# Altium project MQP_DC_AC_Inverter.PrjPcb (part 4 of 4)
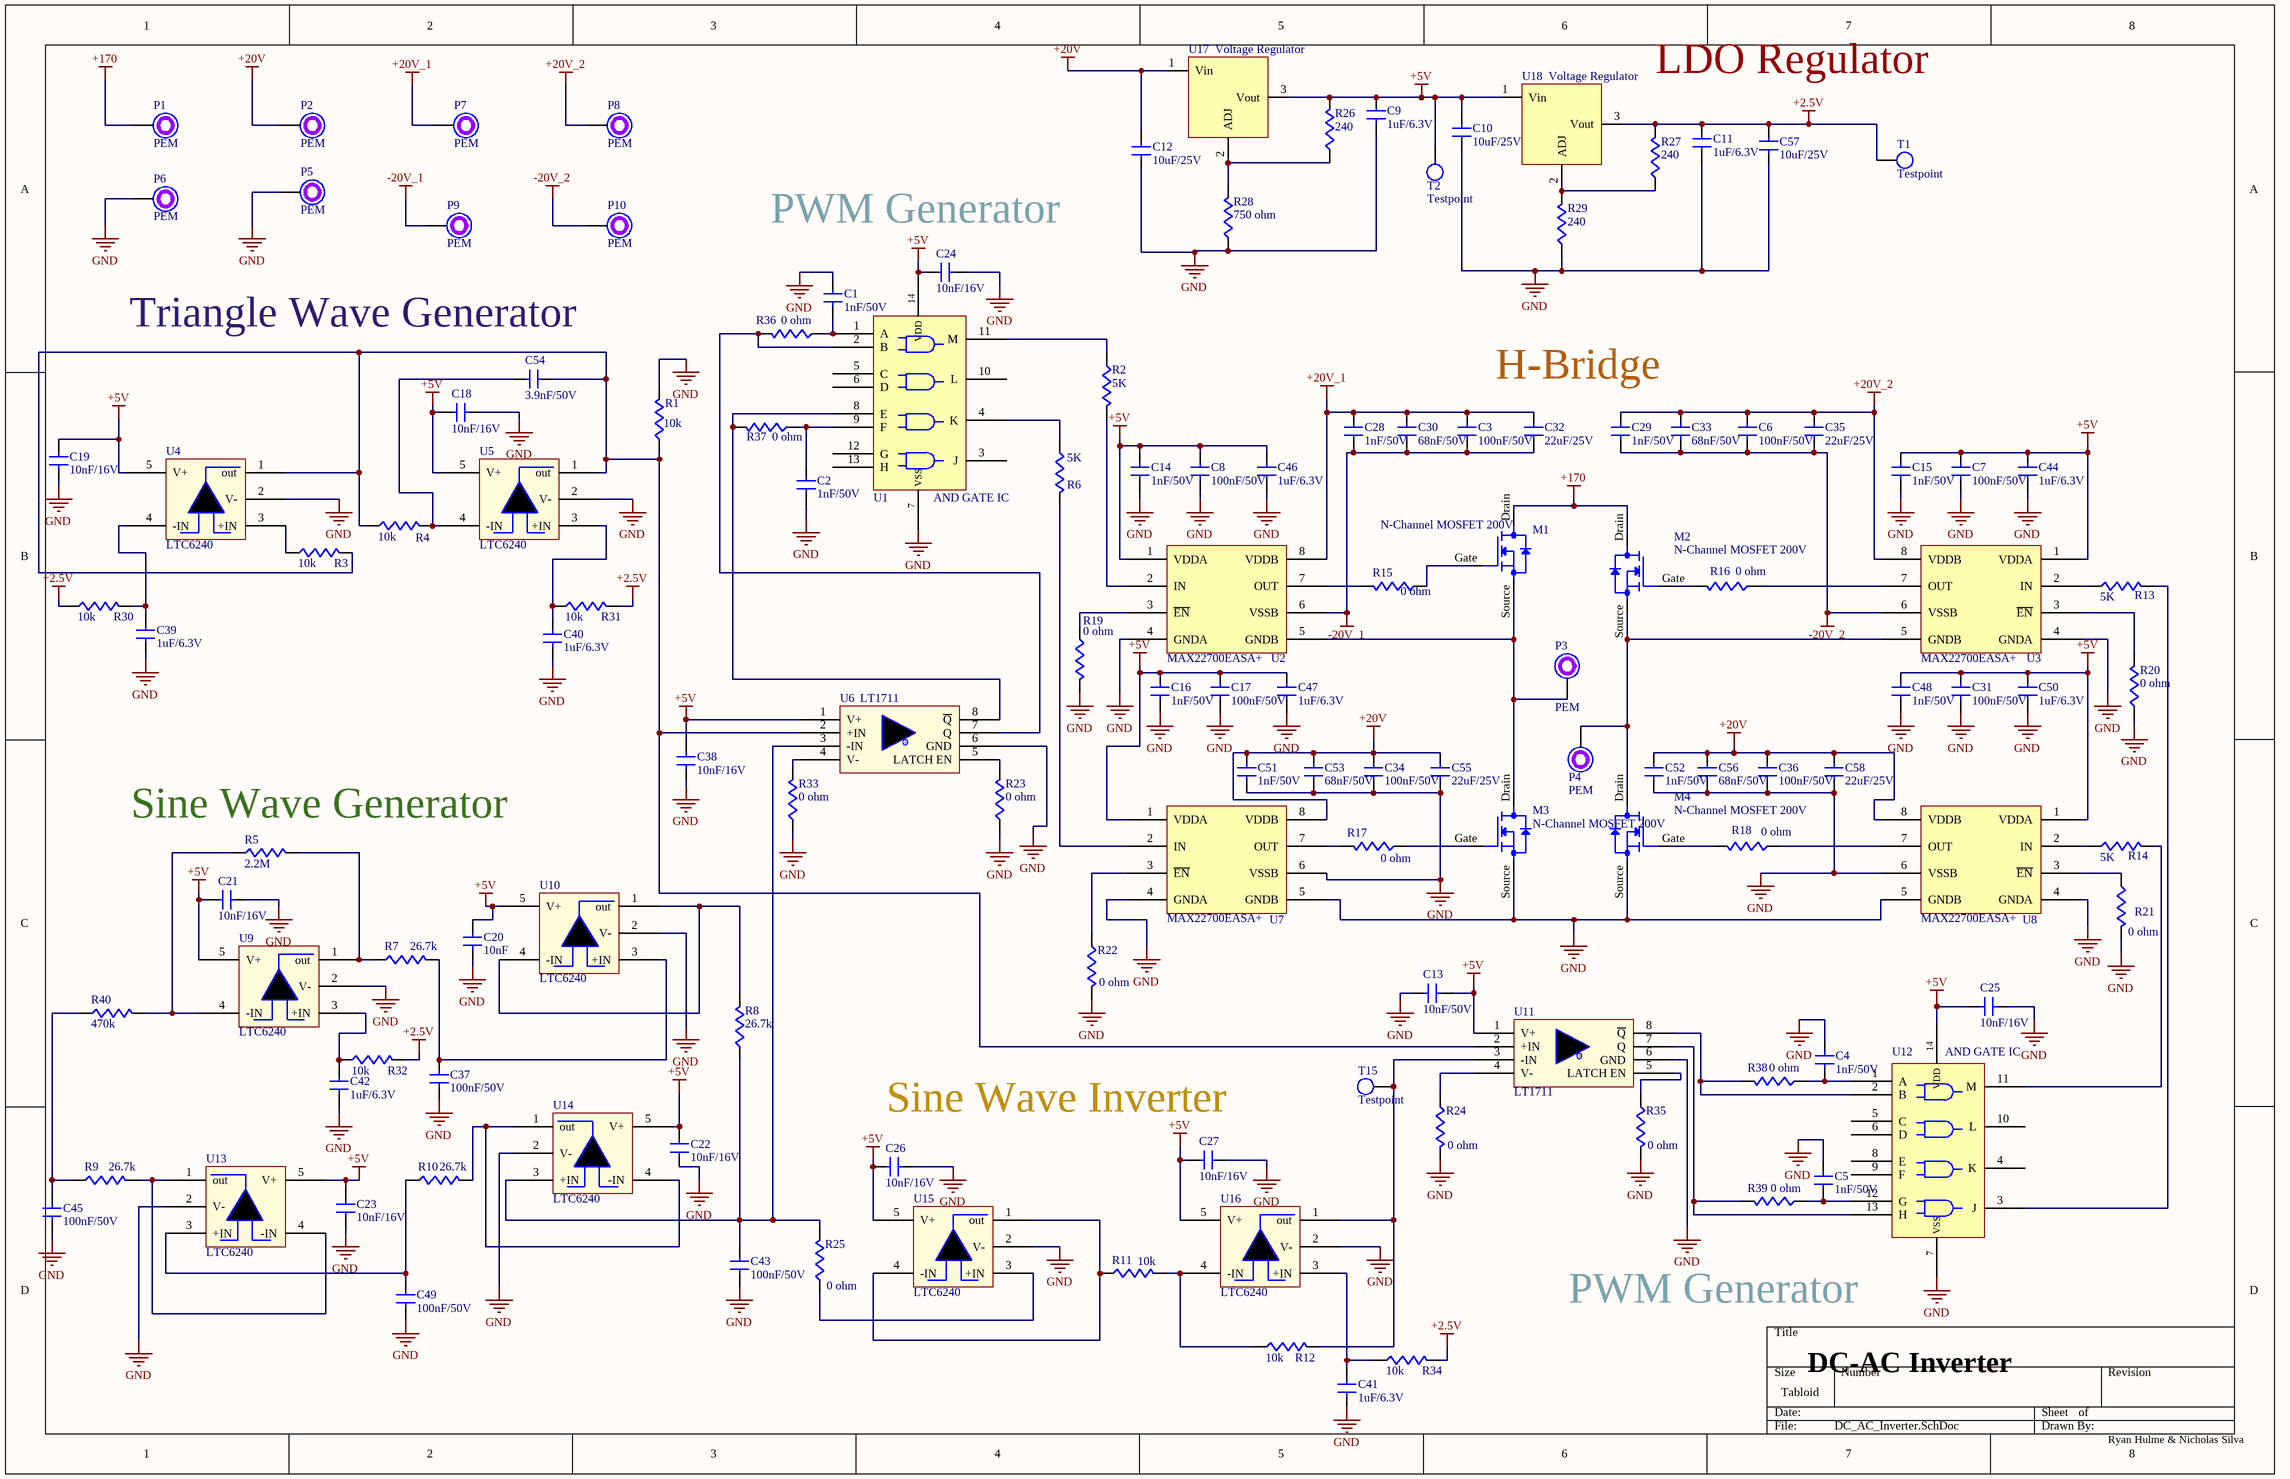
[diagram p3: DC_AC_Inverter.SchDoc]

## Sheet DC_AC_Inverter.SchDoc (continued)

### Library data of the parts (continued)
U1 U12 = CD4081BNSR: AND CD4081 EAR99 4000B logic gate circuit 90ns @ 15V 50pF 2mm 3.4mA 3.4mA 3.5V-11V; Manufacturer: Texas Instruments; Manufacturer Lifecycle Status: ACTIVE; High Level Output Current: -4.2mA; Low Level Output Current: 4.2mA; Max Supply Voltage: 18V; Min Supply Voltage: 3V; Number of Bits: 4; Number of Input Lines: 2; Number of Output Lines: 1; Output Current: 6.8mA; Quiescent Current: 5µA; Turn-On Delay Time: 12ns; Supplier: DigiKey; Supplier Part Number: 296-14140-1-ND; Manufacturer Part Number: CD4081BNSR; RoHS: Compliant; Category: Logic Gates; Stock: 18442; Pricing: 1=1.05, 10=0.759, 25=0.6852, 100=0.6044, 250=0.56576, 500=0.54468 (USD); Case/Package: SOP; Contact Plating: Gold; Height: 2mm; Lead Free: Lead Free; Length: 10.3mm; Lifecycle Status: Production; Logic Function: AND; Max Operating Temperature: 125°C; Min Operating Temperature: -55°C; Mounting Technology: Surface Mount; Number of Circuits: 4; Number of Elements: 4; Number of Gates: 4; Number of Inputs: 2; Number of Outputs: 1; Pins: 14; Packaging: Tape & Reel (TR); Propagation Delay: 90ns; Radiation Hardening: No; REACH SVHC: Unknown; Schedule B: 8542390000, 8542390000|8542390000|8542390000|8542390000|8542390000; Thickness: 1.95mm; Weight: 208.312296mg; Width: 5.3mm; ComponentLink1URL: https://datasheet.octopart.com:443/CD4081BNSR-Texas-Instruments-datasheet-10794629.pdf?src-supplier=Texas+Instruments; ComponentLink1Description: https://datasheet.octopart.com:443/CD4081BNSR-Texas-Instruments-datasheet-10794629.pdf?src-supplier=Texas+Instruments; ComponentLink2URL: https://octopart.com:443/opatz8j6/c1?t=YxbNdJKEROS6Vm5KtYNJ_JyZt7EceMX1SIRKQtAb4Y8lWUVkYy39ZyZsE2-WATvXZN4TSf20npuENvJODiCamDGCNWilka1l9iY4MkQYjKrpUEBaOEb4I2_cjKmMvO0DzDUmCdmSlAdJj-YSBZskjReuIVWeu6zcmJhI4EWYC-jOIWhKVjLUC_2s64ZlV_TJwr1GUdjj7NQs9rSYcxVAXH8GRRzJ5L1klAQGmdoT7dVvhwtaa6KXKHm16KdF4QYR2F57j4FMw7rbM3S3FyRlCmusYW7cmmmcGzT9BesW2olY17NxMao1sKhRxMKa-IHifCTXBKwmACtW2WB27Rp4O6n1txafArR9v5gRBTXi256STLSQN5zqflUpFaagCkJJpZWf&src-supplier=Texas+Instruments; ComponentLink2Description: https://octopart.com:443/opatz8j6/c1?t=YxbNdJKEROS6Vm5KtYNJ_JyZt7EceMX1SIRKQtAb4Y8lWUVkYy39ZyZsE2-WATvXZN4TSf20npuENvJODiCamDGCNWilka1l9iY4MkQYjKrpUEBaOEb4I2_cjKmMvO0DzDUmCdmSlAdJj-YSBZskjReuIVWeu6zcmJhI4EWYC-jOIWhKVjLUC_2s64ZlV_TJwr1GUdjj7NQs9rSYcxVAXH8GRRzJ5L1klAQGmdoT7dVvhwtaa6KXKHm16KdF4QYR2F57j4FMw7rbM3S3FyRlCmusYW7cmmmcGzT9BesW2olY17NxMao1sKhRxMKa-IHifCTXBKwmACtW2WB27Rp4O6n1txafArR9v5gRBTXi256STLSQN5zqflUpFaagCkJJpZWf&src-supplier=Texas+Instruments; ComponentLink3URL: https://datasheet.octopart.com:443/CD4081BNSR-Texas-Instruments-datasheet-10253444.pdf?src-supplier=Texas+Instruments; ComponentLink3Description: https://datasheet.octopart.com:443/CD4081BNSR-Texas-Instruments-datasheet-10253444.pdf?src-supplier=Texas+Instruments; ComponentLink4URL: https://sigma.octopart.com:443/49249817/technical_drawing/Texas-Instruments-CD4081BNSR.pdf?src-supplier=Texas+Instruments; ComponentLink4Description: https://sigma.octopart.com:443/49249817/technical_drawing/Texas-Instruments-CD4081BNSR.pdf?src-supplier=Texas+Instruments; ComponentLink5URL: https://datasheet.octopart.com:443/CD4081BNSR-Texas-Instruments-datasheet-151253.pdf?src-supplier=Texas+Instruments; ComponentLink5Description: https://datasheet.octopart.com:443/CD4081BNSR-Texas-Instruments-datasheet-151253.pdf?src-supplier=Texas+Instruments; ComponentLink6URL: https://datasheet.octopart.com:443/CD4081BNSR-Texas-Instruments-datasheet-10253518.pdf?src-supplier=Texas+Instruments; ComponentLink6Description: https://datasheet.octopart.com:443/CD4081BNSR-Texas-Instruments-datasheet-10253518.pdf?src-supplier=Texas+Instruments; ComponentLink7URL: https://datasheet.octopart.com:443/CD4081BNSR-Texas-Instruments-datasheet-164413312.pdf?src-supplier=SHENGYU+ELECTRONICS; ComponentLink7Description: https://datasheet.octopart.com:443/CD4081BNSR-Texas-Instruments-datasheet-164413312.pdf?src-supplier=SHENGYU+ELECTRONICS; ComponentLink8URL: https://datasheet.octopart.com:443/CD4081BNSR-Texas-Instruments-datasheet-47642733.pdf?src-supplier=Newark; ComponentLink8Description: https://datasheet.octopart.com:443/CD4081BNSR-Texas-Instruments-datasheet-47642733.pdf?src-supplier=Newark; ComponentLink9URL: https://datasheet.octopart.com:443/CD4081BNSR-Texas-Instruments-datasheet-27379352.pdf?src-supplier=Newark; ComponentLink9Description: https://datasheet.octopart.com:443/CD4081BNSR-Texas-Instruments-datasheet-27379352.pdf?src-supplier=Newark; ComponentLink10URL: https://datasheet.octopart.com:443/CD4081BNSR-Texas-Instruments-datasheet-11534476.pdf?src-supplier=Newark; ComponentLink10Description: https://datasheet.octopart.com:443/CD4081BNSR-Texas-Instruments-datasheet-11534476.pdf?src-supplier=Newark; ComponentLink11URL: https://datasheet.octopart.com:443/CD4081BNSR-Texas-Instruments-datasheet-14147925.pdf?src-supplier=iiiC; ComponentLink11Description: https://datasheet.octopart.com:443/CD4081BNSR-Texas-Instruments-datasheet-14147925.pdf?src-supplier=iiiC; ComponentLink12URL: https://datasheet.octopart.com:443/CD4081BNSR-Texas-Instruments-datasheet-10549843.pdf?src-supplier=Factory+Futures; ComponentLink12Description: https://datasheet.octopart.com:443/CD4081BNSR-Texas-Instruments-datasheet-10549843.pdf?src-supplier=Factory+Futures; ComponentLink13URL: https://datasheet.octopart.com:443/CD4081BNSR-Texas-Instruments-datasheet-32637.pdf?src-supplier=DigiKey; ComponentLink13Description: https://datasheet.octopart.com:443/CD4081BNSR-Texas-Instruments-datasheet-32637.pdf?src-supplier=DigiKey; ComponentLink14URL: http://sigma.octopart.com:80/reach_statement/Texas-Instruments-company-64.pdf?src-supplier=Compliance+Statements; ComponentLink14Description: http://sigma.octopart.com:80/reach_statement/Texas-Instruments-company-64.pdf?src-supplier=Compliance+Statements; ComponentLink15URL: http://sigma.octopart.com:80/conflict_mineral_statement/Texas-Instruments-company-63.pdf?src-supplier=Compliance+Statements; ComponentLink15Description: http://sigma.octopart.com:80/conflict_mineral_statement/Texas-Instruments-company-63.pdf?src-supplier=Compliance+Statements
U2 U3 U7 U8 = MAX22700EASA+: MOSFET and Power Driver 5.7A Single Hi/Lo Side Inv/Non-Inv 8-Pin SOIC N; Manufacturer: Analog Devices; Manufacturer Lifecycle Status: PRODUCTION; Supplier: DigiKey; Manufacturer Part Number: MAX22700EASA+; RoHS: Compliant; Category: Gate Drivers; Stock: 18; Pricing: 1=4.56, 10=3.467, 25=3.1924, 100=2.8907, 300=2.72233, 500=2.66008, 1000=2.58869, 2500=2.51336 (USD); Lifecycle Status: Production; ComponentLink1URL: https://octopart.com:443/opatz8j6/c1?t=d9IZSUmFVmeiFEza4JYbjCWptqKSo-oQrcC1b9HLTjM8SgyuA4rt-UKLM_lg9g92uG_YGkggQNQDDUh9x4eYhYYEMlQ8EOGcy0xOKi9661-_2CNFuO_xUPCr0tlrUuDNx5JxL_q4fqwVbfWNc6gzFK95mza5n0-2OqiRTSdQMqBJJ3jfFhDTTNhArzy4ja8X3-lVsfTDz1_T9Hz63hwEk8N8vFkwyr2QE6k72H11354Duarn8LyBg1osG7gxDlOgtPiAaIzdtHupEHI9cRpmJmLPIvktPYVFuVJHI9DYJJb4FuPS1DQFZqpfVzQ&src-supplier=Analog+Devices; ComponentLink1Description: https://octopart.com:443/opatz8j6/c1?t=d9IZSUmFVmeiFEza4JYbjCWptqKSo-oQrcC1b9HLTjM8SgyuA4rt-UKLM_lg9g92uG_YGkggQNQDDUh9x4eYhYYEMlQ8EOGcy0xOKi9661-_2CNFuO_xUPCr0tlrUuDNx5JxL_q4fqwVbfWNc6gzFK95mza5n0-2OqiRTSdQMqBJJ3jfFhDTTNhArzy4ja8X3-lVsfTDz1_T9Hz63hwEk8N8vFkwyr2QE6k72H11354Duarn8LyBg1osG7gxDlOgtPiAaIzdtHupEHI9cRpmJmLPIvktPYVFuVJHI9DYJJb4FuPS1DQFZqpfVzQ&src-supplier=Analog+Devices; ComponentLink2URL: https://datasheet.octopart.com:443/MAX22700EASA%2B-Analog-Devices-datasheet-145303846.pdf?src-supplier=Ciiva; ComponentLink2Description: https://datasheet.octopart.com:443/MAX22700EASA%2B-Analog-Devices-datasheet-145303846.pdf?src-supplier=Ciiva; ComponentLink3URL: http://sigma.octopart.com:80/conflict_mineral_statement/Analog-Devices-company-33.pdf?src-supplier=Compliance+Statements; ComponentLink3Description: http://sigma.octopart.com:80/conflict_mineral_statement/Analog-Devices-company-33.pdf?src-supplier=Compliance+Statements; ComponentLink4URL: http://sigma.octopart.com:80/conflict_mineral_statement/Maxim-Integrated-company-65.pdf?src-supplier=Compliance+Statements; ComponentLink4Description: http://sigma.octopart.com:80/conflict_mineral_statement/Maxim-Integrated-company-65.pdf?src-supplier=Compliance+Statements; ComponentLink5URL: http://sigma.octopart.com:80/rohs_statement/Maxim-Integrated-company-66.pdf?src-supplier=Compliance+Statements; ComponentLink5Description: http://sigma.octopart.com:80/rohs_statement/Maxim-Integrated-company-66.pdf?src-supplier=Compliance+Statements; ComponentLink6URL: http://sigma.octopart.com:80/reach_statement/Maxim-Integrated-company-67.pdf?src-supplier=Compliance+Statements; ComponentLink6Description: http://sigma.octopart.com:80/reach_statement/Maxim-Integrated-company-67.pdf?src-supplier=Compliance+Statements; ComponentLink7URL: https://octopart.com:443/opatz8j6/c1?t=uq9ks65Rkl-f3xSZdxgFjQRktIJqr0XuISwlccZ9Be3A96kxw8KZXdJ2R1X8XijkZLzXX_Xf2iZ_1EYJiUW-k3O4zzF9VXGePyBlVwW68QXhCbuH73gJl5377Ogb3TIEqv1OFx2-kQa3MNaShuM43P0kqkThB15XIv8QEBeG0XiKApOZKBhFvtXuZuIU7_A7qb6Iwuw6Bk-DseikFnDV46qMQ0MwWtmQC_KZQpuB1lSHH6Kpq4IZwI1eexe3v5AcbCWclbrw0yEalPIZQxO6oIfrtCgyasXv1NOmGCZnwU25xZx-CHft1dwr-KU&src-supplier=Compliance+Statements; ComponentLink7Description: https://octopart.com:443/opatz8j6/c1?t=uq9ks65Rkl-f3xSZdxgFjQRktIJqr0XuISwlccZ9Be3A96kxw8KZXdJ2R1X8XijkZLzXX_Xf2iZ_1EYJiUW-k3O4zzF9VXGePyBlVwW68QXhCbuH73gJl5377Ogb3TIEqv1OFx2-kQa3MNaShuM43P0kqkThB15XIv8QEBeG0XiKApOZKBhFvtXuZuIU7_A7qb6Iwuw6Bk-DseikFnDV46qMQ0MwWtmQC_KZQpuB1lSHH6Kpq4IZwI1eexe3v5AcbCWclbrw0yEalPIZQxO6oIfrtCgyasXv1NOmGCZnwU25xZx-CHft1dwr-KU&src-supplier=Compliance+Statements; Supplier Part Number: 505-MAX22700EASA+-ND
U4 U5 U9 U10 U13-U16 = LTC6240HVCS5#TRPBF: Single 18MHz, Low Noise, Rail-to-Rail Output, CMOS Op Amp; Manufacturer: Analog Devices; Manufacturer Lifecycle Status: PRODUCTION; Common Mode Rejection Ratio: 80dB; Input Bias Current: 500fA; Input Offset Voltage (Vos): 40µV; Max Dual Supply Voltage: 5.5V; Max Supply Voltage: 12V; Min Dual Supply Voltage: 1.4V; Min Supply Voltage: 2.8V; Number of Channels: 1; Operating Supply Current: 2.7mA; Output Current per Channel: 35mA; Slew Rate: 10V/µs; Voltage Gain: 124.08dB; Supplier: DigiKey; Supplier Part Number: LTC6240HVCS5#TRPBFCT-ND; Manufacturer Part Number: LTC6240HVCS5#TRPBF; RoHS: Compliant; Category: Amplifiers - Op Amps, Buffer, Instrumentation; Stock: 608; Pricing: 1=5.62, 10=3.682, 25=3.178, 100=2.6081, 250=2.32816, 500=2.15598, 1000=2.0875 (USD); Case/Package: SOT-23-5; Gain Bandwidth Product: 18MHz; Lifecycle Status: Production; Max Operating Temperature: 70°C; Min Operating Temperature: 0°C; Nominal Gain Bandwidth Product: 18MHz; Number of Circuits: 1; Number of Elements: 1; Pins: 5; Power Supply Rejection Ratio (PSRR): 80dB; Schedule B: 8542330000; ComponentLink1URL: https://octopart.com:443/opatz8j6/c1?t=EoJOC4xHGWqq0IzwURpvuTilUJr6oxn8FCFETNO4Zq2hCVGiVcszmCedJy3IM0JOiUrIiZW9OAkJEQuEVAP-9E-dA8NA1y2i1SkXDiRrK1hKzR0l3o3qbUhDn6e2gsbGFkXSeOh1NRwjTJqd3iDw0CugYr4FYbUt-t-yfMuHmZvzr6pA2z0fXrsVIGq1zoMZRKJzy6TiYnY4VDdrN1O0MY2z6NltC_O6gViF_xTQrYt4hMzkVZYWRWTFVHrCY31KCHJLiGAuWLJr-XK7_W8ecdUcfdWHr6PujJR28pJyTDxpp5OPCnCSHhk&src-supplier=Analog+Devices; ComponentLink1Description: https://octopart.com:443/opatz8j6/c1?t=EoJOC4xHGWqq0IzwURpvuTilUJr6oxn8FCFETNO4Zq2hCVGiVcszmCedJy3IM0JOiUrIiZW9OAkJEQuEVAP-9E-dA8NA1y2i1SkXDiRrK1hKzR0l3o3qbUhDn6e2gsbGFkXSeOh1NRwjTJqd3iDw0CugYr4FYbUt-t-yfMuHmZvzr6pA2z0fXrsVIGq1zoMZRKJzy6TiYnY4VDdrN1O0MY2z6NltC_O6gViF_xTQrYt4hMzkVZYWRWTFVHrCY31KCHJLiGAuWLJr-XK7_W8ecdUcfdWHr6PujJR28pJyTDxpp5OPCnCSHhk&src-supplier=Analog+Devices; ComponentLink2URL: https://datasheet.octopart.com:443/LTC6240HVCS5%23TRPBF-Analog-Devices-datasheet-10696582.pdf?src-supplier=Upverter; ComponentLink2Description: https://datasheet.octopart.com:443/LTC6240HVCS5%23TRPBF-Analog-Devices-datasheet-10696582.pdf?src-supplier=Upverter; ComponentLink3URL: https://sigma.octopart.com:443/57691980/technical_drawing/Linear-Technology-LTC6240HVCS5%23TRPBF.pdf?src-supplier=Linear+Technology; ComponentLink3Description: https://sigma.octopart.com:443/57691980/technical_drawing/Linear-Technology-LTC6240HVCS5%23TRPBF.pdf?src-supplier=Linear+Technology; ComponentLink4URL: https://datasheet.octopart.com:443/LTC6240HVCS5%23TRPBF-Linear-Technology-datasheet-503439.pdf?src-supplier=Component+Distributors+Inc.; ComponentLink4Description: https://datasheet.octopart.com:443/LTC6240HVCS5%23TRPBF-Linear-Technology-datasheet-503439.pdf?src-supplier=Component+Distributors+Inc.; ComponentLink5URL: http://sigma.octopart.com:80/conflict_mineral_statement/Analog-Devices-company-33.pdf?src-supplier=Compliance+Statements; ComponentLink5Description: http://sigma.octopart.com:80/conflict_mineral_statement/Analog-Devices-company-33.pdf?src-supplier=Compliance+Statements; ComponentLink6URL: https://octopart.com:443/opatz8j6/c1?t=WciAb8yNP9zuV9g87N3rk5A8aCwiNghx0T8LnhJFV6mKRZRGd55L4dKBPqx6qz3aqpltFHBg-8-BEwTcxfVEDGCQmnON-Gh2PRs8fnVgja709s1gnSHSPuZXis5aMSZAZOU881N3PgSj_buHp1gdatZw-Uix3fDtvuX3209Gm_KbWJ2H22rQDQ9m-2pL5NIQ_aaWB8j4M3xvDUEKrJd1jVzLSn7BPdLnFgEQCROBfoqhRN-2s8LQTzaPSFCP_0_4CdaH0GP8ZwV9vcO0T0oUPTEZ_K4gady1_XxW9ouI33HB3rRb-AWCaPQ&src-supplier=Compliance+Statements; ComponentLink6Description: https://octopart.com:443/opatz8j6/c1?t=WciAb8yNP9zuV9g87N3rk5A8aCwiNghx0T8LnhJFV6mKRZRGd55L4dKBPqx6qz3aqpltFHBg-8-BEwTcxfVEDGCQmnON-Gh2PRs8fnVgja709s1gnSHSPuZXis5aMSZAZOU881N3PgSj_buHp1gdatZw-Uix3fDtvuX3209Gm_KbWJ2H22rQDQ9m-2pL5NIQ_aaWB8j4M3xvDUEKrJd1jVzLSn7BPdLnFgEQCROBfoqhRN-2s8LQTzaPSFCP_0_4CdaH0GP8ZwV9vcO0T0oUPTEZ_K4gady1_XxW9ouI33HB3rRb-AWCaPQ&src-supplier=Compliance+Statements
U6 U11 = LT1711CMS8#TRPBF: Comparator, 1 Func, 6000uV Offset-Max, 5.5ns Response Time, PDSO8; Manufacturer: Analog Devices; Manufacturer Lifecycle Status: PRODUCTION; Common Mode Rejection Ratio: 85dB; Dual Supply Voltage: 3V; Hysteresis: 100mV; Input Bias Current: 5µA; Input Offset Voltage (Vos): 5mV; Max Dual Supply Voltage: 3.5V; Max Supply Voltage: 12V; Min Dual Supply Voltage: 1.2V; Min Supply Voltage: 2.4V; Number of Channels: 1; Output Current: 20mA; Output Type: TTL; Propagation Delay: 6ns; Quiescent Current: 22mA; Voltage Gain: 83.52dB; Supplier: DigiKey; Supplier Part Number: LT1711CMS8#TRPBFCT-ND; Manufacturer Part Number: LT1711CMS8#TRPBF; RoHS: Compliant; Category: Comparators; Stock: 597; Pricing: 1=8.28, 10=5.556, 25=4.846, 100=4.0433, 250=3.6492, 500=3.55 (USD); Case/Package: MSOP; Lead Free: Lead Free; Lifecycle Status: Production; Max Operating Temperature: 85°C; Min Operating Temperature: -40°C; Number of Elements: 1; Pins: 8; Packaging: Tape & Reel (TR); Power Supply Rejection Ratio (PSRR): 85dB; Response Time: 5.5ns; ComponentLink1URL: https://datasheet.octopart.com:443/LT1711CMS8%23TRPBF-Analog-Devices-datasheet-10875408.pdf?src-supplier=Upverter; ComponentLink1Description: https://datasheet.octopart.com:443/LT1711CMS8%23TRPBF-Analog-Devices-datasheet-10875408.pdf?src-supplier=Upverter; ComponentLink2URL: https://octopart.com:443/opatz8j6/c1?t=650wlvKgRWePQJ-YQfhsSkbrZKYDfddFKR30Pp4clKTLmQX5EVcfxF7zy-kc5koLkDxHTRYRN_B3Ny87B9bmV_c9SyVMUnfKuNcS4mmeLxWPRV8jKqIUNmt9U3DobyKC0m2MBwfFbz01P5Hy_wy0NXjMJyXdAbGyqFhD_jhyaJfJ26v792jlQm0ErKRp1UjjVY9BZslcaskmKsL6xJsX4oNUx0LtaC6UIuSKqy15rF3GND51pM_3zZ9lo8oMlZmILwm2IzCFUc_NrKjwIWQ5WZVa4euGqcnDRfh7_s6LA3x7C_zoIgl14A&src-supplier=Analog+Devices; ComponentLink2Description: https://octopart.com:443/opatz8j6/c1?t=650wlvKgRWePQJ-YQfhsSkbrZKYDfddFKR30Pp4clKTLmQX5EVcfxF7zy-kc5koLkDxHTRYRN_B3Ny87B9bmV_c9SyVMUnfKuNcS4mmeLxWPRV8jKqIUNmt9U3DobyKC0m2MBwfFbz01P5Hy_wy0NXjMJyXdAbGyqFhD_jhyaJfJ26v792jlQm0ErKRp1UjjVY9BZslcaskmKsL6xJsX4oNUx0LtaC6UIuSKqy15rF3GND51pM_3zZ9lo8oMlZmILwm2IzCFUc_NrKjwIWQ5WZVa4euGqcnDRfh7_s6LA3x7C_zoIgl14A&src-supplier=Analog+Devices; ComponentLink3URL: https://sigma.octopart.com:443/57689691/technical_drawing/Linear-Technology-LT1711CMS8%23TRPBF.pdf?src-supplier=Linear+Technology; ComponentLink3Description: https://sigma.octopart.com:443/57689691/technical_drawing/Linear-Technology-LT1711CMS8%23TRPBF.pdf?src-supplier=Linear+Technology; ComponentLink4URL: https://datasheet.octopart.com:443/LT1711CMS8%23TRPBF-Linear-Technology-datasheet-531423.pdf?src-supplier=Arrow+Electronics; ComponentLink4Description: https://datasheet.octopart.com:443/LT1711CMS8%23TRPBF-Linear-Technology-datasheet-531423.pdf?src-supplier=Arrow+Electronics; ComponentLink5URL: https://datasheet.octopart.com:443/LT1711CMS8%23TRPBF-Linear-Technology-datasheet-8633398.pdf?src-supplier=Component+Distributors+Inc.; ComponentLink5Description: https://datasheet.octopart.com:443/LT1711CMS8%23TRPBF-Linear-Technology-datasheet-8633398.pdf?src-supplier=Component+Distributors+Inc.; ComponentLink6URL: http://sigma.octopart.com:80/conflict_mineral_statement/Analog-Devices-company-33.pdf?src-supplier=Compliance+Statements; ComponentLink6Description: http://sigma.octopart.com:80/conflict_mineral_statement/Analog-Devices-company-33.pdf?src-supplier=Compliance+Statements; ComponentLink7URL: https://octopart.com:443/opatz8j6/c1?t=dAkp5kuc4KinSuP60yLax01msfIdztXowOgvkuxzK3Ra-UG4s06W2o_Xknc9JFX10aGYdTDUDBu2YNVFrkx2WBDwiC1YG88wO0ahyiKjj84zGTHOqe6cdtECQCEg93bmhFrsTCKVU7XbI3Zx06BEHOSu75LsOIq3TdBLQ5RT2DUKzT7jTBeQnoZARtK9_sxDhnuz0peBXUPQFjmRShESnohF-C6lickybiUrna3amnDJggXX-SPCJw8XiYYPkAdcaGi6qpHt1rmN3o5XFTfLIZB1rU2ryKzDVzzLOCbWDs5ZWSHRXIcx7Q&src-supplier=Compliance+Statements; ComponentLink7Description: https://octopart.com:443/opatz8j6/c1?t=dAkp5kuc4KinSuP60yLax01msfIdztXowOgvkuxzK3Ra-UG4s06W2o_Xknc9JFX10aGYdTDUDBu2YNVFrkx2WBDwiC1YG88wO0ahyiKjj84zGTHOqe6cdtECQCEg93bmhFrsTCKVU7XbI3Zx06BEHOSu75LsOIq3TdBLQ5RT2DUKzT7jTBeQnoZARtK9_sxDhnuz0peBXUPQFjmRShESnohF-C6lickybiUrna3amnDJggXX-SPCJw8XiYYPkAdcaGi6qpHt1rmN3o5XFTfLIZB1rU2ryKzDVzzLOCbWDs5ZWSHRXIcx7Q&src-supplier=Compliance+Statements
U17 U18 = LT317AT#PBF: LDO Regulator Pos 1.5A 3-Pin(3+Tab) TO-220; Manufacturer: Analog Devices; Manufacturer Lifecycle Status: PRODUCTION; Dropout Voltage: 2.5V; Max Supply Voltage: 40V; Min Input Voltage: 3V; Number of Channels: 1; Output Type: Adjustable; Output Voltage Accuracy: 1%; Polarity: Positive; Reference Voltage: 1.25V; Supplier: DigiKey; Supplier Part Number: 505-LT317AT#PBF-ND; Manufacturer Part Number: LT317AT#PBF; RoHS: Compliant; Category: Voltage Regulators - Linear; Stock: 773; Pricing: 1=6.37, 10=4.896, 50=4.3046, 100=4.1214, 250=3.928, 500=3.81142, 1000=3.71547, 2500=3.61417 (USD); Case/Package: TO-220; Height: 14.886mm; Lead Free: Lead Free; Length: 10.69mm; Lifecycle Status: Production; Max Operating Temperature: 125°C; Max Output current: 1.5A; Min Current Limit: 1.5A; Min Operating Temperature: 0°C; Mounting Technology: Through Hole; Number of Outputs: 1; Pins: 3; Number of Regulators: 1; Output Current: 1.5A; Packaging: Bulk; REACH SVHC: No; Schedule B: 8542390000, 8542390000|8542390000|8542390000|8542390000|8542390000|8542390000|8542390000|8542390000|8542390000|8542390000|8542390000|8542390000|8542390000|8542390000|8542390000|8542390000|8542390000|8542390000|8542390000|8542390000|8542390000|8542390000|8542390000|85; Tolerance: 1%; Width: 4.572mm; ComponentLink1URL: https://octopart.com:443/opatz8j6/c1?t=tdoiWRgwZnV-Wph107wcHS5xQQXSIdO2-gyuBhF36HPp7t9yl-Td0csXaHC6kf42ttkNy5k4FvsX6PxBomCL0zX1cJp6livUo3VcnVMqaO14i1GaDjF3JVd6-9oOOBs7C29wDgI-QKi5yyCG6FfzAKxSdPPuF69YPUS-NO0Sm5gTlSwZ2ZL3tbi_UnVguRaZJZl5o1g4mHwEAghi5QAsAvWfoFOn7YTYqrJw1tyji750Y7Uz6wtF9kQQDVuHzX_OsyqcxduaQsGHQSbiI2FVTswyENmvOewqRtRFtIHnqbKI_68J1sI-&src-supplier=Analog+Devices; ComponentLink1Description: https://octopart.com:443/opatz8j6/c1?t=tdoiWRgwZnV-Wph107wcHS5xQQXSIdO2-gyuBhF36HPp7t9yl-Td0csXaHC6kf42ttkNy5k4FvsX6PxBomCL0zX1cJp6livUo3VcnVMqaO14i1GaDjF3JVd6-9oOOBs7C29wDgI-QKi5yyCG6FfzAKxSdPPuF69YPUS-NO0Sm5gTlSwZ2ZL3tbi_UnVguRaZJZl5o1g4mHwEAghi5QAsAvWfoFOn7YTYqrJw1tyji750Y7Uz6wtF9kQQDVuHzX_OsyqcxduaQsGHQSbiI2FVTswyENmvOewqRtRFtIHnqbKI_68J1sI-&src-supplier=Analog+Devices; ComponentLink2URL: https://datasheet.octopart.com:443/LT317AT%23PBF-Analog-Devices-datasheet-14357770.pdf?src-supplier=Linear+Technology; ComponentLink2Description: https://datasheet.octopart.com:443/LT317AT%23PBF-Analog-Devices-datasheet-14357770.pdf?src-supplier=Linear+Technology; ComponentLink3URL: https://sigma.octopart.com:443/57689916/technical_drawing/Linear-Technology-LT317AT%23PBF.pdf?src-supplier=Linear+Technology; ComponentLink3Description: https://sigma.octopart.com:443/57689916/technical_drawing/Linear-Technology-LT317AT%23PBF.pdf?src-supplier=Linear+Technology; ComponentLink4URL: https://datasheet.octopart.com:443/LT317AT%23PBF-Linear-Technology-datasheet-7628552.pdf?src-supplier=Nu+Horizons; ComponentLink4Description: https://datasheet.octopart.com:443/LT317AT%23PBF-Linear-Technology-datasheet-7628552.pdf?src-supplier=Nu+Horizons; ComponentLink5URL: https://datasheet.octopart.com:443/LT317AT%23PBF-Linear-Technology-datasheet-526547.pdf?src-supplier=Farnell; ComponentLink5Description: https://datasheet.octopart.com:443/LT317AT%23PBF-Linear-Technology-datasheet-526547.pdf?src-supplier=Farnell; ComponentLink6URL: https://datasheet.octopart.com:443/LT317AT%23PBF-Linear-Technology-datasheet-530213.pdf?src-supplier=Farnell; ComponentLink6Description: https://datasheet.octopart.com:443/LT317AT%23PBF-Linear-Technology-datasheet-530213.pdf?src-supplier=Farnell; ComponentLink7URL: http://sigma.octopart.com:80/conflict_mineral_statement/Analog-Devices-company-33.pdf?src-supplier=Compliance+Statements; ComponentLink7Description: http://sigma.octopart.com:80/conflict_mineral_statement/Analog-Devices-company-33.pdf?src-supplier=Compliance+Statements; ComponentLink8URL: https://octopart.com:443/opatz8j6/c1?t=JX-HlaGeagCKLogq6AWfLzWzIGWXGD7G-aJPOdFQQk1YBPE6TRsS4g_GCD3O9PwGoDK8T74oP8tfOzPo3LZsKQh3Wf5m0non0nDaxxZsATcNxQsOvV_cHkJVj1UJryIwVmjht0TZjItwWmrLTt9mgAN_Jdw0b9-T9qwNWwn3p6ynmb2yvY2RgQnPw8Npwy0UnlpHeB5gXTOA9CBEG8loW_y7i_LyiYydq06s3X1evJpsdhOcp5CC6-ulsNahPFfhP3qXtmoF3UJG_lKiwKNvd1uy_Il9GfXWm35m8Won24wHtfrQpeFk&src-supplier=Compliance+Statements; ComponentLink8Description: https://octopart.com:443/opatz8j6/c1?t=JX-HlaGeagCKLogq6AWfLzWzIGWXGD7G-aJPOdFQQk1YBPE6TRsS4g_GCD3O9PwGoDK8T74oP8tfOzPo3LZsKQh3Wf5m0non0nDaxxZsATcNxQsOvV_cHkJVj1UJryIwVmjht0TZjItwWmrLTt9mgAN_Jdw0b9-T9qwNWwn3p6ynmb2yvY2RgQnPw8Npwy0UnlpHeB5gXTOA9CBEG8loW_y7i_LyiYydq06s3X1evJpsdhOcp5CC6-ulsNahPFfhP3qXtmoF3UJG_lKiwKNvd1uy_Il9GfXWm35m8Won24wHtfrQpeFk&src-supplier=Compliance+Statements